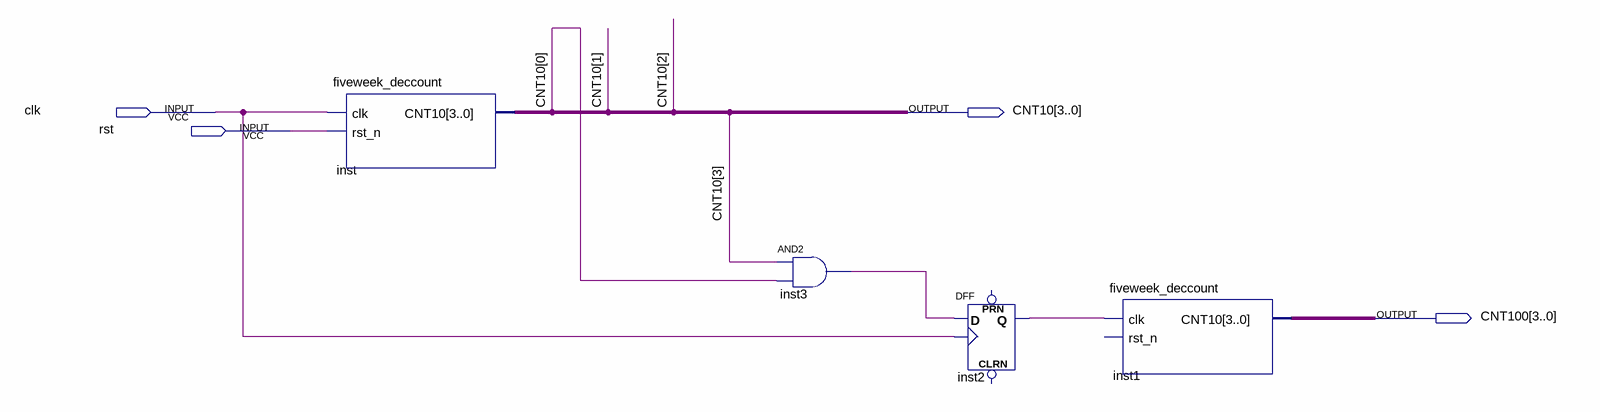
[diagram p0: schematic sheet]
// Quartus schematic hw1.bdf as structural Verilog: 4 symbols, 4 pins
module hw1 (
  input  clk,
  input  rst,
  output [3:0] CNT10,
  output [3:0] CNT100
);

  wire inst2_q, inst3_out;

  fiveweek_deccount inst (.clk(clk), .rst_n(rst), .CNT10(CNT10));
  and inst3 (inst3_out, CNT10[3], CNT10[0]);
  DFF inst2 (.CLK(clk), .D(inst3_out), .Q(inst2_q));  // open: CLRN, PRN
  fiveweek_deccount inst1 (.clk(inst2_q), .CNT10(CNT100));  // open: rst_n
endmodule
